# EAGLE design cpu-fast (EAGLE 7.0.0)
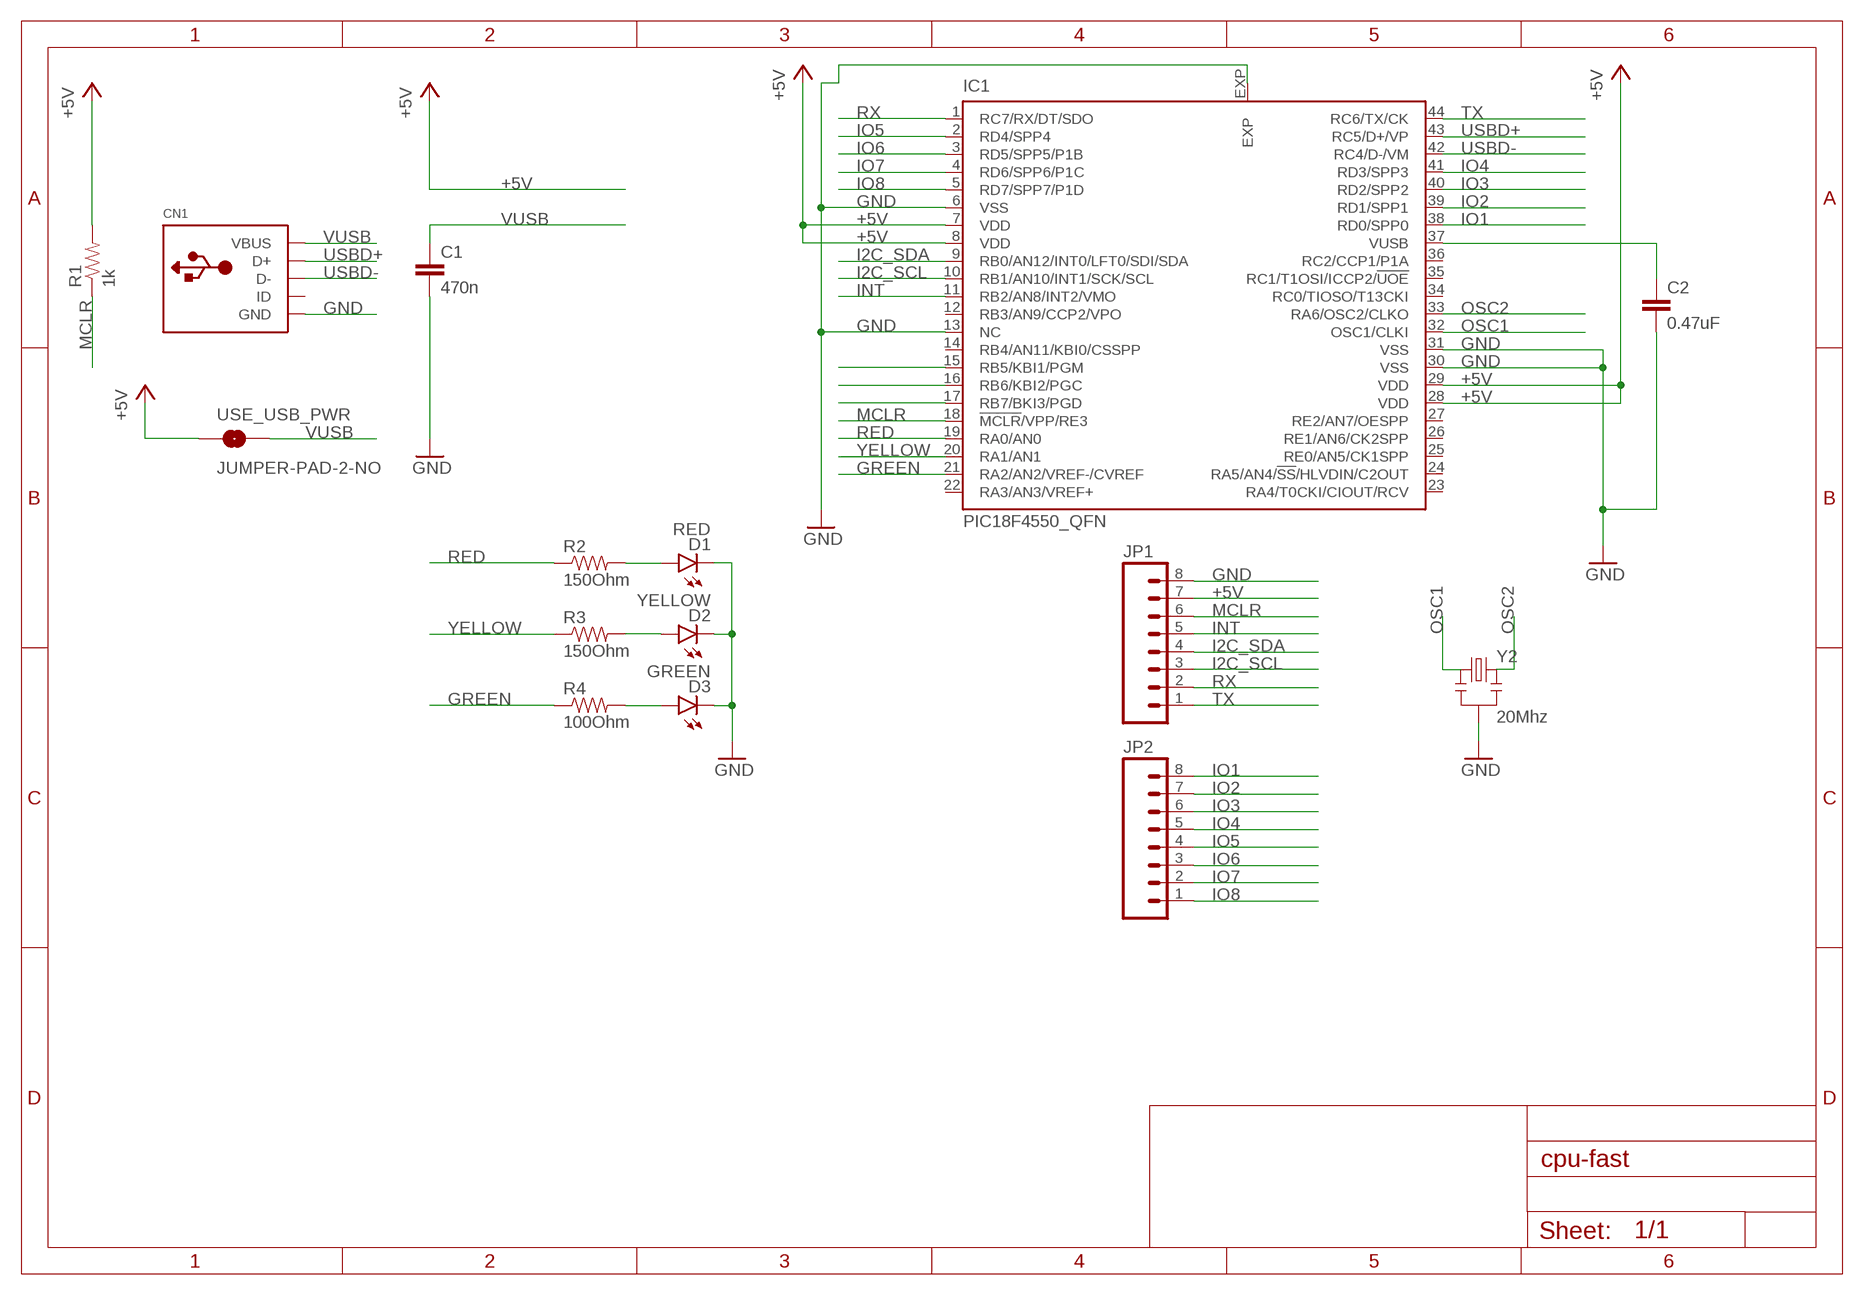
[diagram p0: schematic, sheet 1]

## Parts
C1  470n  C-EUC0805K  [C0805K]
C2  0.47uF  0.22UF-25V-10%(0603)  [0603-CAP]
CN1  USBMINIB  [USB-MINIB]
D1  RED  LED-RED0603  [LED-0603]
D2  YELLOW  LED-YELLOW0603  [LED-0603]
D3  GREEN  LED-GREEN0603  [LED-0603]
IC1  PIC18F4550_QFN  [QFN44ML8X8]
JP1  M081X08  [1X08]
JP2  M081X08  [1X08]
R1  1k  RESISTOR0402-RES  [0402-RES]
R2  150Ohm  RESISTOR0402-RES  [0402-RES]
R3  150Ohm  RESISTOR0402-RES  [0402-RES]
R4  100Ohm  RESISTOR0402-RES  [0402-RES]
USE_USB_PWR  JUMPER-PAD-2-NO  [PAD-JUMPER-2-NO_NO_SILK]
Y2  20Mhz  RESONATOR16MHZ  [RESONATOR-SMD]

## Nets
+5V: IC1.7(VDD) IC1.8(VDD) IC1.28(VDD) IC1.29(VDD) JP1.7 R1.2 USE_USB_PWR.1
GND: C1.2 C2.2 CN1.GND D1.C D2.C D3.C IC1.6(VSS) IC1.13(NC) IC1.30(VSS) IC1.31(VSS) IC1.EXP JP1.8 Y2.2
GREEN: IC1.21(RA2/AN2/VREF-/CVREF) R4.1
I2C_SCL: IC1.10(RB1/AN10/INT1/SCK/SCL) JP1.3
I2C_SDA: IC1.9(RB0/AN12/INT0/LFT0/SDI/SDA) JP1.4
INT: IC1.11(RB2/AN8/INT2/VMO) JP1.5
IO1: IC1.38(RD0/SPP0) JP2.8
IO2: IC1.39(RD1/SPP1) JP2.7
IO3: IC1.40(RD2/SPP2) JP2.6
IO4: IC1.41(RD3/SPP3) JP2.5
IO5: IC1.2(RD4/SPP4) JP2.4
IO6: IC1.3(RD5/SPP5/P1B) JP2.3
IO7: IC1.4(RD6/SPP6/P1C) JP2.2
IO8: IC1.5(RD7/SPP7/P1D) JP2.1
MCLR: IC1.18(!MCLR!/VPP/RE3) JP1.6 R1.1
N$1: D1.A R2.2
N$2: D2.A R3.2
N$3: D3.A R4.2
N$4: IC1.17(RB7/BKI3/PGD)
N$5: IC1.16(RB6/KBI2/PGC)
N$6: IC1.15(RB5/KBI1/PGM)
N$7: C2.1 IC1.37(VUSB)
OSC1: IC1.32(OSC1/CLKI) Y2.1
OSC2: IC1.33(RA6/OSC2/CLKO) Y2.3
RED: IC1.19(RA0/AN0) R2.1
RX: IC1.1(RC7/RX/DT/SDO) JP1.2
TX: IC1.44(RC6/TX/CK) JP1.1
USBD+: CN1.D+ IC1.43(RC5/D+/VP)
USBD-: CN1.D- IC1.42(RC4/D-/VM)
VUSB: C1.1 CN1.VBUS USE_USB_PWR.2
YELLOW: IC1.20(RA1/AN1) R3.1
Unconnected: CN1.ID IC1.12(RB3/AN9/CCP2/VPO) IC1.14(RB4/AN11/KBI0/CSSPP) IC1.22(RA3/AN3/VREF+) IC1.23(RA4/T0CKI/CIOUT/RCV) IC1.24(RA5/AN4/!SS!/HLVDIN/C2OUT) IC1.25(RE0/AN5/CK1SPP) IC1.26(RE1/AN6/CK2SPP) IC1.27(RE2/AN7/OESPP) IC1.34(RC0/TIOSO/T13CKI) IC1.35(RC1/T1OSI/ICCP2/!UOE) IC1.36(RC2/CCP1/P1A)

## Library data of the parts
C1 = rcl:C-EU: CAPACITOR, European symbol
C2 = SparkFun-Capacitors:0.22UF-25V-10%(0603): CAP-07822; PROD_ID: CAP-07822; VALUE: 0.22uF
CN1 = adafruit:USB: USB Connectors USBMINIB - Surface Mount Female Mini-B USB Connector 4UConnector: 06564 By microbuilder.eu Thru-hole RA Female Mini-B USB Connector 4UConnector: 18732 By ladyada.net
D1 = SparkFun-LED:LED-RED: Assorted Red LEDs LilyPad 1206- DIO-09912 1206- DIO-00809 0603- DIO-00819; PROD_ID: DIO-00819
D2 = SparkFun-LED:LED-YELLOW: Yellow SMD LEDs LilyPad 1206- DIO-09909 0603- DIO-09003; PROD_ID: DIO-09003
D3 = SparkFun-LED:LED-GREEN: Various green LEDs Green LEDs used in SFE Production 0603- DIO-00821 LARGE- DIO-00862 LILYPAD- DIO-09910; PROD_ID: DIO-00821
IC1 = microchip:PIC18F4*_QFN: USB Microcontrollers with nanoWatt Technology High-Performance, Enhanced Flash, 28/40/44-Pin, Source: http://ww1.microchip.com/downloads/en/devicedoc/39632c.pdf; MF: MICROCHIP; MPN: PIC18F4550-I/ML; OC_FARNELL: 1292276; OC_NEWARK: 08J9631
JP1 JP2 = SparkFun-Connectors:M08: Header 8 Standard 8-pin 0.1" header. Use with straight break away headers (SKU : PRT-00116), right angle break away headers (PRT-00553), swiss pins (PRT-00743), machine pins (PRT-00117), and female headers (PRT-00115).
R1-R4 = SparkFun-Passives:RESISTOR: Resistor Basic schematic elements and footprints for 0603, 1206, and PTH resistors.
USE_USB_PWR = SparkFun-Passives:JUMPER-PAD-2-NO
Y2 = SparkFun-FreqCtrl:RESONATOR: Resonator Small SMD resonator. Used, eg, on the Arduino Pro/ Pro Mini boards. 8MHz- XTAL-08895 16MHz- XTAL-08900; PROD_ID: XTAL-08900; VALUE: 16MHZ

## Board
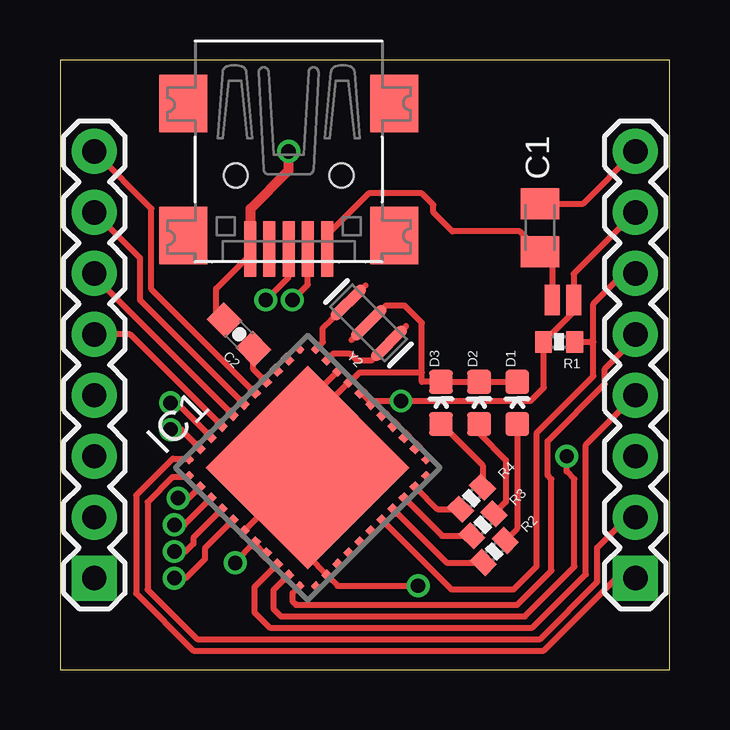
[diagram p1: board, top side]
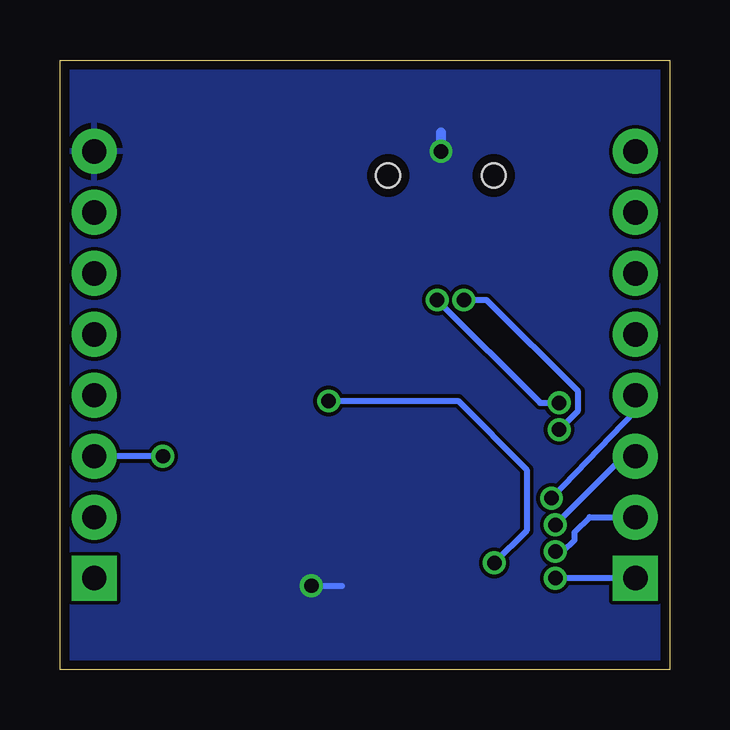
[diagram p2: board, bottom side, seen from below]

Size 25.4 x 25.4 mm. Coordinates in mm from the lower left corner, seen from the top.
Outline: 0,0 25.4,0 25.4,25.4 0,25.4 0,0
Copper layers (1*16): Top 0.0356mm / dielectric 1.5011mm / Bottom 0.0356mm
Design rules "LaenPCBOrder": minimum track width 6mil, minimum drill 13mil, track to track 6mil, track to pad 6mil, pad to pad 6mil, via to via 6mil, smd to smd 6mil, copper to edge 15mil, drill to drill 6mil, minimum pad ring 7mil, minimum via ring 7mil, stop-mask expansion 3mil, vias tented up to drill 0mil, thermal gap 10mil

### Footprints (pad centres in the part's own frame; a part is rotated, then mirrored left to right if it is on the bottom)
C0805K = smd 1.3 x 1.6: 1 -1,0; 2 1,0
0603-CAP = smd 1.1 x 1: 1 -0.85,0; 2 0.85,0
USB-MINIB = smd 0.5 x 2.308: D+ 0,4.064; D- -0.8,4.064; GND 1.6,4.064; ID 0.8,4.064; VBUS -1.6,4.064 | smd 2 x 2.4: GND1 -4.4,-2; GND2 -4.4,3.5; GND3 4.4,3.5; GND4 4.4,-2 | hole 1: -2.2,1; 2.2,1
LED-0603 = smd 1 x 1: A 0,-0.877; C 0,0.877
QFN44ML8X8 = smd 0.45 x 0.33: 1 -3.788,3.25; 2 -3.788,2.6; 3 -3.788,1.95; 4 -3.788,1.3; 5 -3.788,0.65; 6 -3.788,0; 7 -3.788,-0.65; 8 -3.788,-1.3; 9 -3.788,-1.95; 10 -3.788,-2.6; 11 -3.788,-3.25; 23 3.788,-3.25; 24 3.788,-2.6; 25 3.788,-1.95; 26 3.788,-1.3; 27 3.788,-0.65; 28 3.788,0; 29 3.788,0.65; 30 3.788,1.3; 31 3.788,1.95; 32 3.788,2.6; 33 3.788,3.25 | smd 0.33 x 0.45: 12 -3.25,-3.788; 13 -2.6,-3.788; 14 -1.95,-3.788; 15 -1.3,-3.788; 16 -0.65,-3.788; 17 0,-3.788; 18 0.65,-3.788; 19 1.3,-3.788; 20 1.95,-3.788; 21 2.6,-3.788; 22 3.25,-3.788; 34 3.25,3.788; 35 2.6,3.788; 36 1.95,3.788; 37 1.3,3.788; 38 0.65,3.788; 39 0,3.788; 40 -0.65,3.788; 41 -1.3,3.788; 42 -1.95,3.788; 43 -2.6,3.788; 44 -3.25,3.788 | smd 6 x 6: EXP 0,0
1X08 = drill 1.016 pad 1.88 square: 1 0,0 | drill 1.016 pad 1.88: 2 2.54,0; 3 5.08,0; 4 7.62,0; 5 10.16,0; 6 12.7,0; 7 15.24,0; 8 17.78,0
0402-RES = smd 0.7 x 0.9: 1 -0.65,0; 2 0.65,0
PAD-JUMPER-2-NO_NO_SILK = smd 0.635 x 1.27: 1 -0.45,0; 2 0.45,0
RESONATOR-SMD = smd 0.45 x 1.905: 1 -1.2,0; 2 0,0; 3 1.2,0

### Placement (x,y rotation side)
C1  20,18.41 90 top
C2  7.46,13.97 135 top
CN1  9.53,21.59 180 top
D1  19.05,11.11 0 top
D2  17.46,11.11 0 top
D3  15.88,11.11 0 top
IC1  10.32,8.41 45 top
JP1  23.97,3.81 90 top
JP2  1.43,3.81 90 top
R1  20.8,13.65 180 top
R2  18.1,4.92 45 top
R3  17.62,6.03 45 top
R4  17.14,7.14 45 top
USE_USB_PWR  20.95,15.4 180 top
Y2  12.86,14.45 135 top

### Tracks (layer width: path | path; a pad name or v marks a point on that pad's centre or on a via)
+5V  (via drill 0.6)
  Top 0.254: IC1.8 IC1.7 7.3,4.48 v7.3,4.45 | IC1.8 | JP1.7 21.41,16.48 USE_USB_PWR.1 21.41,14.91 R1.2 20.16,13.64 20.16,11.75 19.61,11.19 v14.21,11.19 13.1,11.19 IC1.28 IC1.29
  Bottom 0.254: v7.3,4.45 5.95,5.79 5.95,8.33 8.81,11.19 v14.21,11.19
GND  (via drill 0.6)
  Top 0.254: IC1.6 9.92,8.02 | 9.92,8.02 IC1.EXP | IC1.EXP 10.32,4.74 IC1.13 11.56,3.49 v14.92,3.49 | IC1.EXP 10.32,10.25 IC1.30 12.1,11.99 12.49,12.38 15.08,12.38 | IC1.31 9.92,10.78 9.92,8.02 | D1.C D2.C D3.C 15.08,11.99 15.08,12.38 | C1.2 21.8,19.41 JP1.8 | 15.08,12.38 15.08,14.45 14.36,15.16 13.58,15.16 | C2.2 6.51,14.92 6.51,15.88 7.92,17.29 CN1.GND
  Top 0.406: CN1.GND 7.94,19.21 9.53,20.8 v9.53,21.59
  Bottom 0.254: v14.92,3.49 13.65,3.49
  Bottom 0.406: v9.53,21.59 9.53,22.38
  pour Bottom: 0,25.4 25.4,25.4 25.4,0 0,0
GREEN
  Top 0.254: IC1.21 15.72,6.68 R4.1
I2C_SCL  (via drill 0.6)
  Top 0.254: IC1.10 8.89,3.31 8.89,2.54 9.21,2.22 19.37,2.22 21.43,4.29 21.43,7.94 21.11,8.26 v21.11,8.89
  Bottom 0.254: v21.11,8.89 JP1.3
I2C_SDA
  Top 0.254: IC1.9 8.1,3.43 8.1,2.38 8.73,1.75 19.68,1.75 21.91,3.97 21.91,9.37 JP1.4
INT
  Top 0.254: IC1.11 9.68,3.18 9.68,2.86 9.84,2.7 19.05,2.7 20.48,4.13 20.48,7.94 20.32,8.1 20.32,9.53 22.7,11.91 22.7,12.54 23.97,13.81 JP1.5
IO1
  Top 0.254: IC1.38 3.81,15.84 3.81,19.21 JP2.8
IO2
  Top 0.254: IC1.39 3.33,15.4 3.33,17.14 JP2.7
IO3
  Top 0.254: IC1.40 1.43,16.39 JP2.6
IO4
  Top 0.254: IC1.41 2.92,13.97 JP2.5
IO5  (via drill 0.6)
  Top 0.254: IC1.2 5.37,7.14 v4.92,7.14
  Bottom 0.254: v4.92,7.14 1.43,10.79 JP2.4
IO6  (via drill 0.6)
  Top 0.254: IC1.3 5.18,6.03 v4.76,6.03
  Bottom 0.254: v4.76,6.03 1.91,8.89 JP2.3
IO7  (via drill 0.6)
  Top 0.254: 5.08,4.92 v4.76,4.92 5.24,4.92 5.56,5.24 5.56,5.49 IC1.4
  Bottom 0.254: JP2.2 3.33,6.35 3.97,5.71 3.97,5.4 4.45,4.92 v4.76,4.92
IO8  (via drill 0.6)
  Top 0.254: 4.8,3.81 v4.76,3.81 5.24,3.81 6.03,4.6 6.03,5.05 IC1.5
  Bottom 0.254: JP2.1 v4.76,3.81
MCLR
  Top 0.254: 22.23,13.65 22.23,12.22 19.84,9.84 19.84,4.29 18.89,3.33 16.32,3.33 IC1.18 | 22.23,13.65 22.23,15.24 23.5,16.51 JP1.6 | R1.1 22.23,13.65
N$1
  Top 0.254: D1.A 19.05,5.87 R2.2
N$2
  Top 0.254: D2.A 17.46,9.84 18.57,8.73 18.57,6.99 R3.2
N$3
  Top 0.254: D3.A 17.61,8.51 R4.2
N$7
  Top 0.254: IC1.37 8.06,12.51 C2.1
OSC1
  Top 0.254: IC1.32 11.4,13.18 12.06,13.18 12.36,12.88 12.99,12.88
OSC2
  Top 0.254: IC1.33 10.95,13.64 10.95,14.24 11.29,14.58
RED
  Top 0.254: IC1.19 16.11,4.46 R2.1
RX
  Top 0.254: JP1.2 23.65,6.35 22.38,5.08 22.38,3.65 20,1.27 5.71,1.27 3.65,3.33 3.65,6.98 4.71,8.03 IC1.1
TX
  Top 0.254: JP1.1 23.18,3.81 20.16,0.79 5.56,0.79 3.17,3.17 3.17,7.26 4.71,8.79 IC1.44
USBD+  (via drill 0.6)
  Top 0.254: IC1.43 5.05,10 v4.6,10 | v8.57,15.4 9.53,16.35 CN1.D+
  Bottom 0.254: v4.6,10 3.81,10.79 3.81,11.59 7.62,15.4 v8.57,15.4
USBD-  (via drill 0.6)
  Top 0.254: IC1.42 4.86,11.11 v4.6,11.11 | v9.68,15.4 10.32,16.04 CN1.D-
  Bottom 0.254: v9.68,15.4 5.4,11.11 v4.6,11.11
VUSB
  Top 0.254: USE_USB_PWR.2 20.5,16.91 C1.1 19.16,18.26 16.35,18.26 15.56,19.05 15.56,19.37 15.08,19.84 12.86,19.84 11.12,18.11 CN1.VBUS
YELLOW
  Top 0.254: IC1.20 15.92,5.57 R3.1